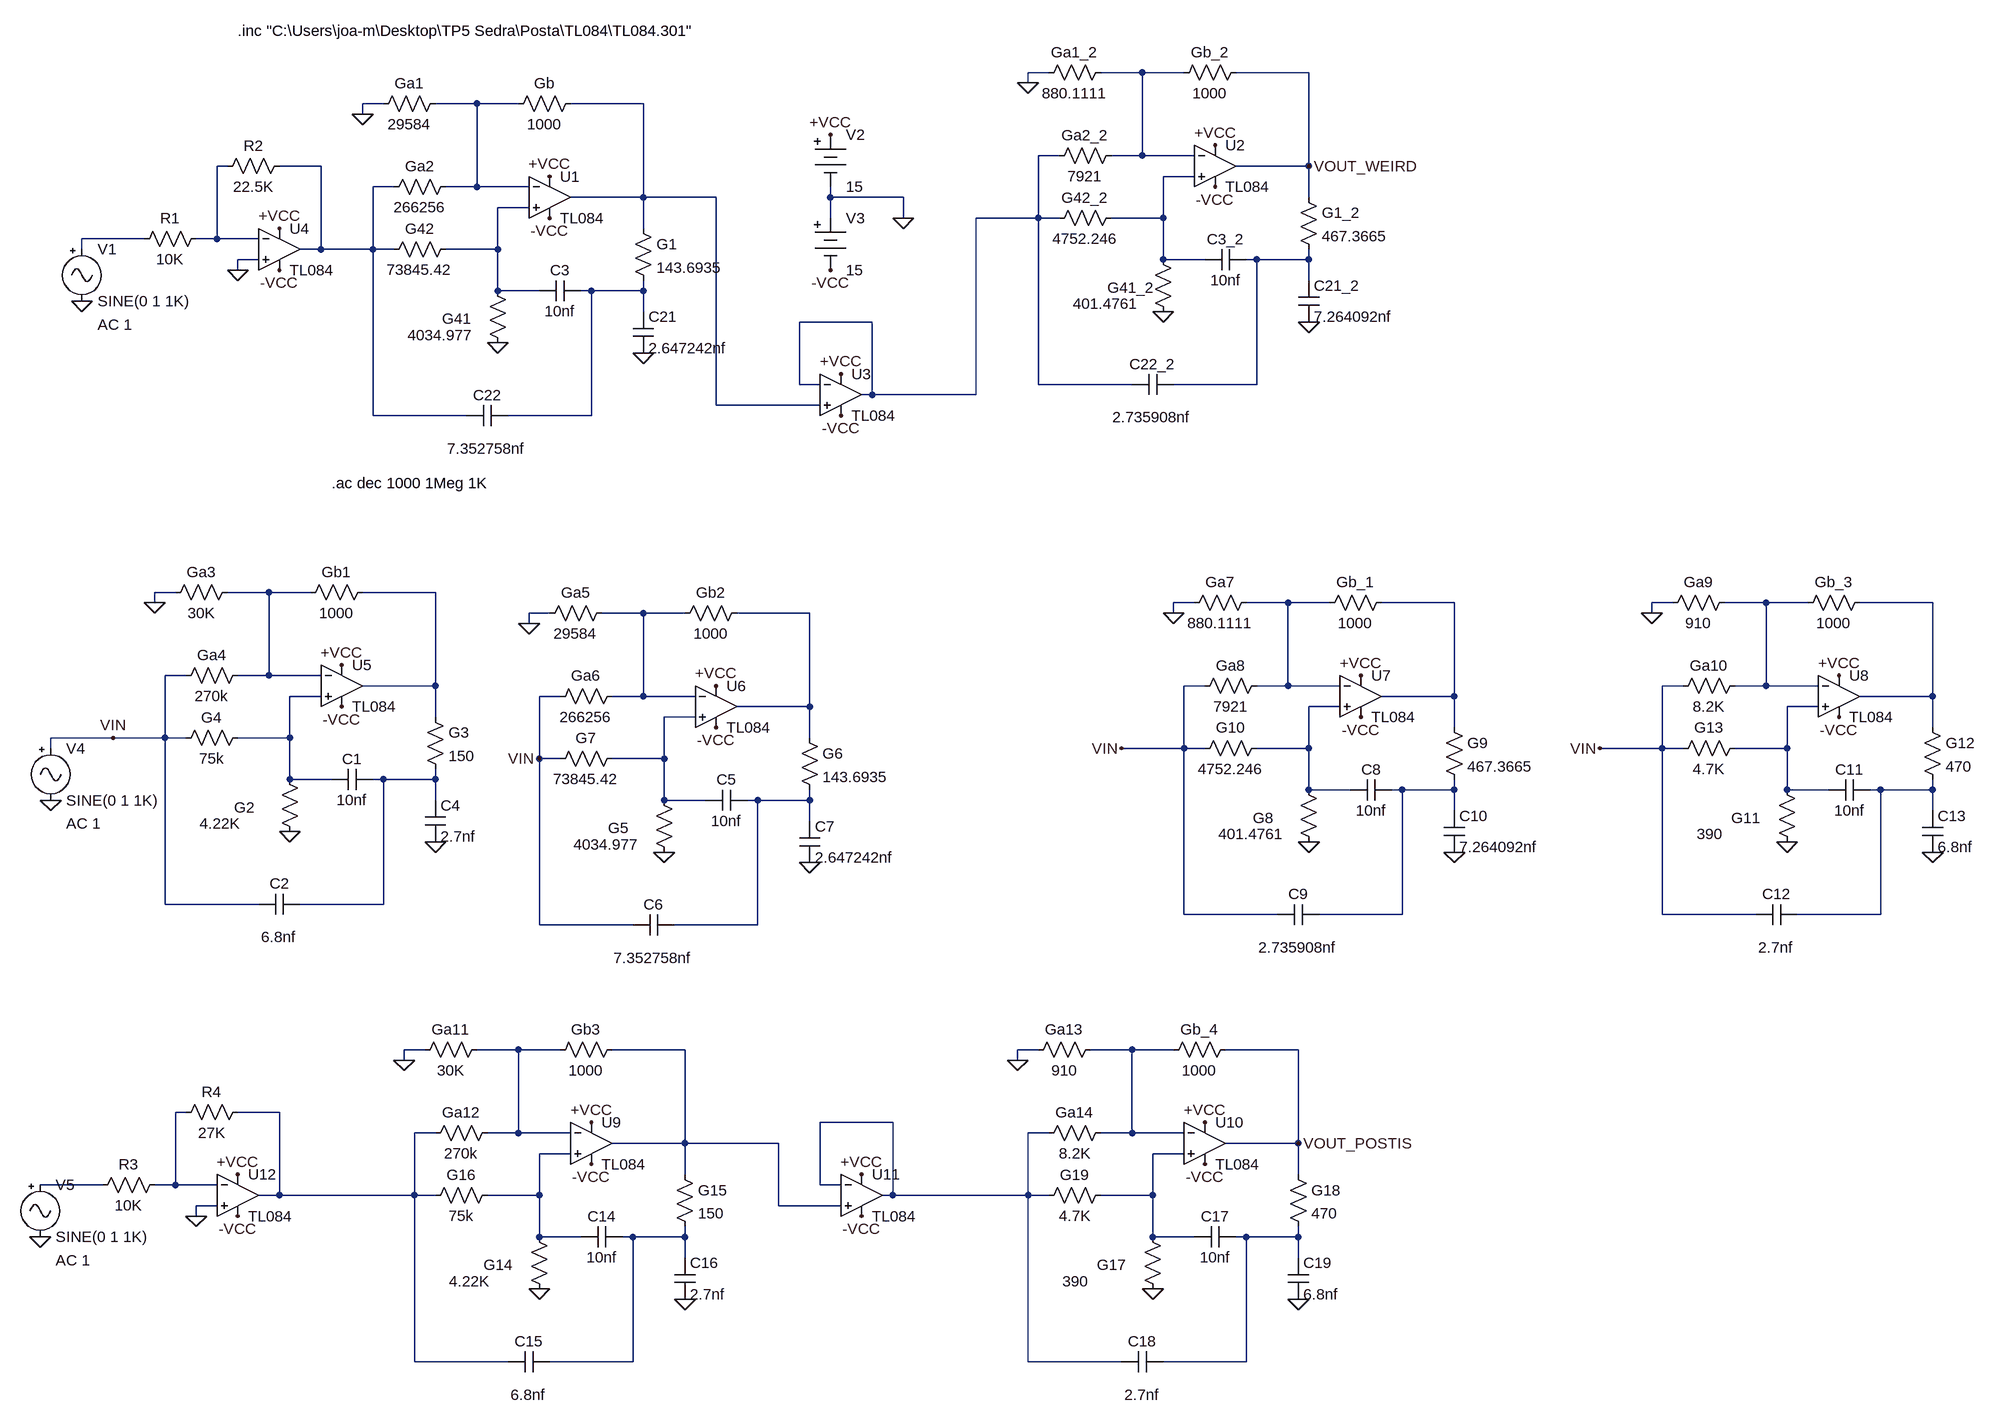
[diagram p0: schematic Sedra.asc]
Sedra.asc, the LTspice schematic file:
Version 4
SHEET 1 3008 2004
WIRE 1168 -48 1136 -48
WIRE 1312 -48 1248 -48
WIRE 1376 -48 1312 -48
WIRE 1568 -48 1456 -48
WIRE 1136 -32 1136 -48
WIRE 144 0 112 0
WIRE 288 0 224 0
WIRE 352 0 288 0
WIRE 544 0 432 0
WIRE 112 16 112 0
WIRE 1184 80 1152 80
WIRE 1312 80 1312 -48
WIRE 1312 80 1264 80
WIRE 1392 80 1312 80
WIRE -96 96 -112 96
WIRE 48 96 -16 96
WIRE 1568 96 1568 -48
WIRE 1568 96 1456 96
WIRE 1392 112 1344 112
WIRE 160 128 128 128
WIRE 288 128 288 0
WIRE 288 128 240 128
WIRE 368 128 288 128
WIRE 544 144 544 0
WIRE 544 144 432 144
WIRE 656 144 544 144
WIRE 832 144 832 128
WIRE 944 144 832 144
WIRE 1568 144 1568 96
WIRE 368 160 320 160
WIRE 832 176 832 144
WIRE 944 176 944 144
WIRE 1152 176 1152 80
WIRE 1152 176 1056 176
WIRE 1184 176 1152 176
WIRE 1344 176 1344 112
WIRE 1344 176 1264 176
WIRE 544 192 544 144
WIRE -224 208 -320 208
WIRE -112 208 -112 96
WIRE -112 208 -144 208
WIRE -48 208 -112 208
WIRE -320 224 -320 208
WIRE 48 224 48 96
WIRE 48 224 16 224
WIRE 128 224 128 128
WIRE 128 224 48 224
WIRE 160 224 128 224
WIRE 320 224 320 160
WIRE 320 224 240 224
WIRE -48 240 -80 240
WIRE 1344 240 1344 176
WIRE 1408 240 1344 240
WIRE 1488 240 1472 240
WIRE 1568 240 1568 224
WIRE 1568 240 1488 240
WIRE -80 256 -80 240
WIRE 1568 272 1568 240
WIRE 320 288 320 224
WIRE 384 288 320 288
WIRE 464 288 448 288
WIRE 544 288 544 272
WIRE 544 288 464 288
WIRE 544 320 544 288
WIRE 896 336 784 336
WIRE 784 432 784 336
WIRE 816 432 784 432
WIRE 1152 432 1152 176
WIRE 1296 432 1152 432
WIRE 1488 432 1488 240
WIRE 1488 432 1360 432
WIRE 896 448 896 336
WIRE 896 448 880 448
WIRE 1056 448 1056 176
WIRE 1056 448 896 448
WIRE 656 464 656 144
WIRE 816 464 656 464
WIRE 128 480 128 224
WIRE 272 480 128 480
WIRE 464 480 464 288
WIRE 464 480 336 480
WIRE -176 752 -208 752
WIRE -32 752 -96 752
WIRE 32 752 -32 752
WIRE 224 752 112 752
WIRE -208 768 -208 752
WIRE 1392 768 1360 768
WIRE 1536 768 1472 768
WIRE 1600 768 1536 768
WIRE 1792 768 1680 768
WIRE 2128 768 2096 768
WIRE 2272 768 2208 768
WIRE 2336 768 2272 768
WIRE 2528 768 2416 768
WIRE 400 784 368 784
WIRE 544 784 480 784
WIRE 608 784 544 784
WIRE 800 784 688 784
WIRE 1360 784 1360 768
WIRE 2096 784 2096 768
WIRE 368 800 368 784
WIRE -160 880 -192 880
WIRE -32 880 -32 752
WIRE -32 880 -80 880
WIRE 48 880 -32 880
WIRE 224 896 224 752
WIRE 224 896 112 896
WIRE 1408 896 1376 896
WIRE 1536 896 1536 768
WIRE 1536 896 1488 896
WIRE 1616 896 1536 896
WIRE 2144 896 2112 896
WIRE 2272 896 2272 768
WIRE 2272 896 2224 896
WIRE 2352 896 2272 896
WIRE 48 912 0 912
WIRE 416 912 384 912
WIRE 544 912 544 784
WIRE 544 912 496 912
WIRE 624 912 544 912
WIRE 1792 912 1792 768
WIRE 1792 912 1680 912
WIRE 2528 912 2528 768
WIRE 2528 912 2416 912
WIRE 800 928 800 784
WIRE 800 928 688 928
WIRE 1616 928 1568 928
WIRE 2352 928 2304 928
WIRE 224 944 224 896
WIRE 624 944 576 944
WIRE 1792 960 1792 912
WIRE 2528 960 2528 912
WIRE -272 976 -368 976
WIRE -192 976 -192 880
WIRE -192 976 -272 976
WIRE -160 976 -192 976
WIRE 0 976 0 912
WIRE 0 976 -80 976
WIRE 800 976 800 928
WIRE -368 992 -368 976
WIRE 1376 992 1376 896
WIRE 1376 992 1280 992
WIRE 1408 992 1376 992
WIRE 1568 992 1568 928
WIRE 1568 992 1488 992
WIRE 2112 992 2112 896
WIRE 2112 992 2016 992
WIRE 2144 992 2112 992
WIRE 2304 992 2304 928
WIRE 2304 992 2224 992
WIRE 384 1008 384 912
WIRE 416 1008 384 1008
WIRE 576 1008 576 944
WIRE 576 1008 496 1008
WIRE 0 1040 0 976
WIRE 64 1040 0 1040
WIRE 144 1040 128 1040
WIRE 224 1040 224 1024
WIRE 224 1040 144 1040
WIRE 1568 1056 1568 992
WIRE 1632 1056 1568 1056
WIRE 1712 1056 1696 1056
WIRE 1792 1056 1792 1040
WIRE 1792 1056 1712 1056
WIRE 2304 1056 2304 992
WIRE 2368 1056 2304 1056
WIRE 2448 1056 2432 1056
WIRE 2528 1056 2528 1040
WIRE 2528 1056 2448 1056
WIRE 224 1072 224 1040
WIRE 576 1072 576 1008
WIRE 640 1072 576 1072
WIRE 720 1072 704 1072
WIRE 800 1072 800 1056
WIRE 800 1072 720 1072
WIRE 1792 1088 1792 1056
WIRE 2528 1088 2528 1056
WIRE 800 1104 800 1072
WIRE -192 1232 -192 976
WIRE -48 1232 -192 1232
WIRE 144 1232 144 1040
WIRE 144 1232 16 1232
WIRE 1376 1248 1376 992
WIRE 1520 1248 1376 1248
WIRE 1712 1248 1712 1056
WIRE 1712 1248 1584 1248
WIRE 2112 1248 2112 992
WIRE 2256 1248 2112 1248
WIRE 2448 1248 2448 1056
WIRE 2448 1248 2320 1248
WIRE 384 1264 384 1008
WIRE 528 1264 384 1264
WIRE 720 1264 720 1072
WIRE 720 1264 592 1264
WIRE 208 1456 176 1456
WIRE 352 1456 288 1456
WIRE 416 1456 352 1456
WIRE 608 1456 496 1456
WIRE 1152 1456 1120 1456
WIRE 1296 1456 1232 1456
WIRE 1360 1456 1296 1456
WIRE 1552 1456 1440 1456
WIRE 176 1472 176 1456
WIRE 1120 1472 1120 1456
WIRE -160 1552 -176 1552
WIRE -16 1552 -80 1552
WIRE 928 1568 816 1568
WIRE 224 1584 192 1584
WIRE 352 1584 352 1456
WIRE 352 1584 304 1584
WIRE 432 1584 352 1584
WIRE 1168 1584 1136 1584
WIRE 1296 1584 1296 1456
WIRE 1296 1584 1248 1584
WIRE 1376 1584 1296 1584
WIRE 608 1600 608 1456
WIRE 608 1600 496 1600
WIRE 752 1600 608 1600
WIRE 1552 1600 1552 1456
WIRE 1552 1600 1440 1600
WIRE 432 1616 384 1616
WIRE 1376 1616 1328 1616
WIRE 608 1648 608 1600
WIRE 1552 1648 1552 1600
WIRE -288 1664 -384 1664
WIRE -176 1664 -176 1552
WIRE -176 1664 -208 1664
WIRE -112 1664 -176 1664
WIRE 816 1664 816 1568
WIRE 848 1664 816 1664
WIRE -16 1680 -16 1552
WIRE -16 1680 -48 1680
WIRE 192 1680 192 1584
WIRE 192 1680 -16 1680
WIRE 224 1680 192 1680
WIRE 384 1680 384 1616
WIRE 384 1680 304 1680
WIRE 928 1680 928 1568
WIRE 928 1680 912 1680
WIRE 1136 1680 1136 1584
WIRE 1136 1680 928 1680
WIRE 1168 1680 1136 1680
WIRE 1328 1680 1328 1616
WIRE 1328 1680 1248 1680
WIRE -112 1696 -144 1696
WIRE 752 1696 752 1600
WIRE 848 1696 752 1696
WIRE -144 1712 -144 1696
WIRE 384 1744 384 1680
WIRE 448 1744 384 1744
WIRE 528 1744 512 1744
WIRE 608 1744 608 1728
WIRE 608 1744 528 1744
WIRE 1328 1744 1328 1680
WIRE 1392 1744 1328 1744
WIRE 1472 1744 1456 1744
WIRE 1552 1744 1552 1728
WIRE 1552 1744 1472 1744
WIRE 608 1776 608 1744
WIRE 1552 1776 1552 1744
WIRE 192 1936 192 1680
WIRE 336 1936 192 1936
WIRE 528 1936 528 1744
WIRE 528 1936 400 1936
WIRE 1136 1936 1136 1680
WIRE 1280 1936 1136 1936
WIRE 1472 1936 1472 1744
WIRE 1472 1936 1344 1936
FLAG 112 16 0
FLAG 544 384 0
FLAG 320 368 0
FLAG -320 304 0
FLAG 944 176 0
FLAG 400 112 +VCC
FLAG 832 48 +VCC
FLAG 400 176 -VCC
FLAG 832 256 -VCC
FLAG 1136 -32 0
FLAG 1568 336 0
FLAG 1344 320 0
FLAG 1424 64 +VCC
FLAG 1424 128 -VCC
FLAG 848 416 +VCC
FLAG 848 480 -VCC
FLAG -16 192 +VCC
FLAG -16 256 -VCC
FLAG -80 256 0
FLAG -208 768 0
FLAG 224 1136 0
FLAG 0 1120 0
FLAG -368 1072 0
FLAG 80 864 +VCC
FLAG 80 928 -VCC
FLAG 368 800 0
FLAG 800 1168 0
FLAG 576 1152 0
FLAG 656 896 +VCC
FLAG 656 960 -VCC
FLAG -272 976 VIN
FLAG 384 1008 VIN
FLAG 1360 784 0
FLAG 1792 1152 0
FLAG 1568 1136 0
FLAG 1648 880 +VCC
FLAG 1648 944 -VCC
FLAG 2096 784 0
FLAG 2528 1152 0
FLAG 2304 1136 0
FLAG 2384 880 +VCC
FLAG 2384 944 -VCC
FLAG 1280 992 VIN
FLAG 2016 992 VIN
FLAG 176 1472 0
FLAG 608 1840 0
FLAG 384 1824 0
FLAG -384 1744 0
FLAG 464 1568 +VCC
FLAG 464 1632 -VCC
FLAG 1120 1472 0
FLAG 1552 1840 0
FLAG 1328 1824 0
FLAG 1408 1568 +VCC
FLAG 1408 1632 -VCC
FLAG 880 1648 +VCC
FLAG 880 1712 -VCC
FLAG -80 1648 +VCC
FLAG -80 1712 -VCC
FLAG -144 1712 0
FLAG 1568 96 VOUT_WEIRD
FLAG 1552 1600 VOUT_POSTIS
SYMBOL Opamps\\opamp2 400 80 R0
SYMATTR InstName U1
SYMATTR Value TL084
SYMATTR SpiceModel TL084
SYMBOL res 128 16 R270
WINDOW 0 32 56 VTop 2
WINDOW 3 0 56 VBottom 2
SYMATTR InstName Ga1
SYMATTR Value 29584
SYMBOL res 336 16 R270
WINDOW 0 32 56 VTop 2
WINDOW 3 0 56 VBottom 2
SYMATTR InstName Gb
SYMATTR Value 1000
SYMBOL res 304 272 R0
WINDOW 0 -70 59 Left 2
WINDOW 3 -123 84 Left 2
SYMATTR InstName G41
SYMATTR Value 4034.977
SYMBOL res 528 176 R0
SYMATTR InstName G1
SYMATTR Value 143.6935
SYMBOL cap 448 272 R90
WINDOW 0 0 32 VBottom 2
WINDOW 3 32 32 VTop 2
SYMATTR InstName C3
SYMATTR Value 10nf
SYMBOL cap 336 464 R90
WINDOW 0 0 32 VBottom 2
WINDOW 3 51 33 VTop 2
SYMATTR InstName C22
SYMATTR Value 7.352758nf
SYMBOL cap 528 320 R0
SYMATTR InstName C21
SYMATTR Value 2.647242nf
SYMBOL Misc\\signal -320 208 R0
WINDOW 123 24 132 Left 2
WINDOW 39 0 0 Left 0
SYMATTR Value2 AC 1
SYMATTR InstName V1
SYMBOL Misc\\battery 832 32 R0
WINDOW 123 0 0 Left 0
WINDOW 39 0 0 Left 0
SYMATTR InstName V2
SYMATTR Value 15
SYMBOL Misc\\battery 832 160 R0
WINDOW 123 0 0 Left 0
WINDOW 39 0 0 Left 0
SYMATTR InstName V3
SYMATTR Value 15
SYMBOL res 256 112 R90
WINDOW 0 0 56 VBottom 2
WINDOW 3 32 56 VTop 2
SYMATTR InstName Ga2
SYMATTR Value 266256
SYMBOL res 256 208 R90
WINDOW 0 0 56 VBottom 2
WINDOW 3 32 56 VTop 2
SYMATTR InstName G42
SYMATTR Value 73845.42
SYMBOL Opamps\\opamp2 1424 32 R0
SYMATTR InstName U2
SYMATTR Value TL084
SYMATTR SpiceModel TL084
SYMBOL res 1152 -32 R270
WINDOW 0 32 56 VTop 2
WINDOW 3 0 56 VBottom 2
SYMATTR InstName Ga1_2
SYMATTR Value 880.1111
SYMBOL res 1360 -32 R270
WINDOW 0 32 56 VTop 2
WINDOW 3 0 56 VBottom 2
SYMATTR InstName Gb_2
SYMATTR Value 1000
SYMBOL res 1328 224 R0
WINDOW 0 -70 59 Left 2
WINDOW 3 -123 84 Left 2
SYMATTR InstName G41_2
SYMATTR Value 401.4761
SYMBOL res 1552 128 R0
SYMATTR InstName G1_2
SYMATTR Value 467.3665
SYMBOL cap 1472 224 R90
WINDOW 0 0 32 VBottom 2
WINDOW 3 32 32 VTop 2
SYMATTR InstName C3_2
SYMATTR Value 10nf
SYMBOL cap 1360 416 R90
WINDOW 0 0 32 VBottom 2
WINDOW 3 51 33 VTop 2
SYMATTR InstName C22_2
SYMATTR Value 2.735908nf
SYMBOL cap 1552 272 R0
SYMATTR InstName C21_2
SYMATTR Value 7.264092nf
SYMBOL res 1280 64 R90
WINDOW 0 0 56 VBottom 2
WINDOW 3 32 56 VTop 2
SYMATTR InstName Ga2_2
SYMATTR Value 7921
SYMBOL res 1280 160 R90
WINDOW 0 0 56 VBottom 2
WINDOW 3 32 56 VTop 2
SYMATTR InstName G42_2
SYMATTR Value 4752.246
SYMBOL Opamps\\opamp2 848 384 R0
SYMATTR InstName U3
SYMATTR Value TL084
SYMATTR SpiceModel TL084
SYMBOL Opamps\\opamp2 -16 160 R0
SYMATTR InstName U4
SYMATTR Value TL084
SYMATTR SpiceModel TL084
SYMBOL res -128 192 R90
WINDOW 0 0 56 VBottom 2
WINDOW 3 32 56 VTop 2
SYMATTR InstName R1
SYMATTR Value 10K
SYMBOL res 0 80 R90
WINDOW 0 0 56 VBottom 2
WINDOW 3 32 56 VTop 2
SYMATTR InstName R2
SYMATTR Value 22.5K
SYMBOL Opamps\\opamp2 80 832 R0
SYMATTR InstName U5
SYMATTR Value TL084
SYMATTR SpiceModel TL084
SYMBOL res -192 768 R270
WINDOW 0 32 56 VTop 2
WINDOW 3 0 56 VBottom 2
SYMATTR InstName Ga3
SYMATTR Value 30K
SYMBOL res 16 768 R270
WINDOW 0 32 56 VTop 2
WINDOW 3 0 56 VBottom 2
SYMATTR InstName Gb1
SYMATTR Value 1000
SYMBOL res -16 1024 R0
WINDOW 0 -70 59 Left 2
WINDOW 3 -123 84 Left 2
SYMATTR InstName G2
SYMATTR Value 4.22K
SYMBOL res 208 928 R0
SYMATTR InstName G3
SYMATTR Value 150
SYMBOL cap 128 1024 R90
WINDOW 0 0 32 VBottom 2
WINDOW 3 32 32 VTop 2
SYMATTR InstName C1
SYMATTR Value 10nf
SYMBOL cap 16 1216 R90
WINDOW 0 0 32 VBottom 2
WINDOW 3 51 33 VTop 2
SYMATTR InstName C2
SYMATTR Value 6.8nf
SYMBOL cap 208 1072 R0
SYMATTR InstName C4
SYMATTR Value 2.7nf
SYMBOL Misc\\signal -368 976 R0
WINDOW 123 24 132 Left 2
WINDOW 39 0 0 Left 0
SYMATTR Value2 AC 1
SYMATTR InstName V4
SYMBOL res -64 864 R90
WINDOW 0 0 56 VBottom 2
WINDOW 3 32 56 VTop 2
SYMATTR InstName Ga4
SYMATTR Value 270k
SYMBOL res -64 960 R90
WINDOW 0 0 56 VBottom 2
WINDOW 3 32 56 VTop 2
SYMATTR InstName G4
SYMATTR Value 75k
SYMBOL Opamps\\opamp2 656 864 R0
SYMATTR InstName U6
SYMATTR Value TL084
SYMATTR SpiceModel TL084
SYMBOL res 384 800 R270
WINDOW 0 32 56 VTop 2
WINDOW 3 0 56 VBottom 2
SYMATTR InstName Ga5
SYMATTR Value 29584
SYMBOL res 592 800 R270
WINDOW 0 32 56 VTop 2
WINDOW 3 0 56 VBottom 2
SYMATTR InstName Gb2
SYMATTR Value 1000
SYMBOL res 560 1056 R0
WINDOW 0 -70 59 Left 2
WINDOW 3 -123 84 Left 2
SYMATTR InstName G5
SYMATTR Value 4034.977
SYMBOL res 784 960 R0
SYMATTR InstName G6
SYMATTR Value 143.6935
SYMBOL cap 704 1056 R90
WINDOW 0 0 32 VBottom 2
WINDOW 3 32 32 VTop 2
SYMATTR InstName C5
SYMATTR Value 10nf
SYMBOL cap 592 1248 R90
WINDOW 0 0 32 VBottom 2
WINDOW 3 51 33 VTop 2
SYMATTR InstName C6
SYMATTR Value 7.352758nf
SYMBOL cap 784 1104 R0
SYMATTR InstName C7
SYMATTR Value 2.647242nf
SYMBOL res 512 896 R90
WINDOW 0 0 56 VBottom 2
WINDOW 3 32 56 VTop 2
SYMATTR InstName Ga6
SYMATTR Value 266256
SYMBOL res 512 992 R90
WINDOW 0 0 56 VBottom 2
WINDOW 3 32 56 VTop 2
SYMATTR InstName G7
SYMATTR Value 73845.42
SYMBOL Opamps\\opamp2 1648 848 R0
SYMATTR InstName U7
SYMATTR Value TL084
SYMATTR SpiceModel TL084
SYMBOL res 1376 784 R270
WINDOW 0 32 56 VTop 2
WINDOW 3 0 56 VBottom 2
SYMATTR InstName Ga7
SYMATTR Value 880.1111
SYMBOL res 1584 784 R270
WINDOW 0 32 56 VTop 2
WINDOW 3 0 56 VBottom 2
SYMATTR InstName Gb_1
SYMATTR Value 1000
SYMBOL res 1552 1040 R0
WINDOW 0 -70 59 Left 2
WINDOW 3 -123 84 Left 2
SYMATTR InstName G8
SYMATTR Value 401.4761
SYMBOL res 1776 944 R0
SYMATTR InstName G9
SYMATTR Value 467.3665
SYMBOL cap 1696 1040 R90
WINDOW 0 0 32 VBottom 2
WINDOW 3 32 32 VTop 2
SYMATTR InstName C8
SYMATTR Value 10nf
SYMBOL cap 1584 1232 R90
WINDOW 0 0 32 VBottom 2
WINDOW 3 51 33 VTop 2
SYMATTR InstName C9
SYMATTR Value 2.735908nf
SYMBOL cap 1776 1088 R0
SYMATTR InstName C10
SYMATTR Value 7.264092nf
SYMBOL res 1504 880 R90
WINDOW 0 0 56 VBottom 2
WINDOW 3 32 56 VTop 2
SYMATTR InstName Ga8
SYMATTR Value 7921
SYMBOL res 1504 976 R90
WINDOW 0 0 56 VBottom 2
WINDOW 3 32 56 VTop 2
SYMATTR InstName G10
SYMATTR Value 4752.246
SYMBOL Opamps\\opamp2 2384 848 R0
SYMATTR InstName U8
SYMATTR Value TL084
SYMATTR SpiceModel TL084
SYMBOL res 2112 784 R270
WINDOW 0 32 56 VTop 2
WINDOW 3 0 56 VBottom 2
SYMATTR InstName Ga9
SYMATTR Value 910
SYMBOL res 2320 784 R270
WINDOW 0 32 56 VTop 2
WINDOW 3 0 56 VBottom 2
SYMATTR InstName Gb_3
SYMATTR Value 1000
SYMBOL res 2288 1040 R0
WINDOW 0 -70 59 Left 2
WINDOW 3 -123 84 Left 2
SYMATTR InstName G11
SYMATTR Value 390
SYMBOL res 2512 944 R0
SYMATTR InstName G12
SYMATTR Value 470
SYMBOL cap 2432 1040 R90
WINDOW 0 0 32 VBottom 2
WINDOW 3 32 32 VTop 2
SYMATTR InstName C11
SYMATTR Value 10nf
SYMBOL cap 2320 1232 R90
WINDOW 0 0 32 VBottom 2
WINDOW 3 51 33 VTop 2
SYMATTR InstName C12
SYMATTR Value 2.7nf
SYMBOL cap 2512 1088 R0
SYMATTR InstName C13
SYMATTR Value 6.8nf
SYMBOL res 2240 880 R90
WINDOW 0 0 56 VBottom 2
WINDOW 3 32 56 VTop 2
SYMATTR InstName Ga10
SYMATTR Value 8.2K
SYMBOL res 2240 976 R90
WINDOW 0 0 56 VBottom 2
WINDOW 3 32 56 VTop 2
SYMATTR InstName G13
SYMATTR Value 4.7K
SYMBOL Opamps\\opamp2 464 1536 R0
SYMATTR InstName U9
SYMATTR Value TL084
SYMATTR SpiceModel TL084
SYMBOL res 192 1472 R270
WINDOW 0 32 56 VTop 2
WINDOW 3 0 56 VBottom 2
SYMATTR InstName Ga11
SYMATTR Value 30K
SYMBOL res 400 1472 R270
WINDOW 0 32 56 VTop 2
WINDOW 3 0 56 VBottom 2
SYMATTR InstName Gb3
SYMATTR Value 1000
SYMBOL res 368 1728 R0
WINDOW 0 -70 59 Left 2
WINDOW 3 -123 84 Left 2
SYMATTR InstName G14
SYMATTR Value 4.22K
SYMBOL res 592 1632 R0
SYMATTR InstName G15
SYMATTR Value 150
SYMBOL cap 512 1728 R90
WINDOW 0 0 32 VBottom 2
WINDOW 3 32 32 VTop 2
SYMATTR InstName C14
SYMATTR Value 10nf
SYMBOL cap 400 1920 R90
WINDOW 0 0 32 VBottom 2
WINDOW 3 51 33 VTop 2
SYMATTR InstName C15
SYMATTR Value 6.8nf
SYMBOL cap 592 1776 R0
SYMATTR InstName C16
SYMATTR Value 2.7nf
SYMBOL Misc\\signal -384 1648 R0
WINDOW 123 24 132 Left 2
WINDOW 39 0 0 Left 0
SYMATTR Value2 AC 1
SYMATTR InstName V5
SYMBOL res 320 1568 R90
WINDOW 0 0 56 VBottom 2
WINDOW 3 32 56 VTop 2
SYMATTR InstName Ga12
SYMATTR Value 270k
SYMBOL res 320 1664 R90
WINDOW 0 0 56 VBottom 2
WINDOW 3 32 56 VTop 2
SYMATTR InstName G16
SYMATTR Value 75k
SYMBOL Opamps\\opamp2 1408 1536 R0
SYMATTR InstName U10
SYMATTR Value TL084
SYMATTR SpiceModel TL084
SYMBOL res 1136 1472 R270
WINDOW 0 32 56 VTop 2
WINDOW 3 0 56 VBottom 2
SYMATTR InstName Ga13
SYMATTR Value 910
SYMBOL res 1344 1472 R270
WINDOW 0 32 56 VTop 2
WINDOW 3 0 56 VBottom 2
SYMATTR InstName Gb_4
SYMATTR Value 1000
SYMBOL res 1312 1728 R0
WINDOW 0 -70 59 Left 2
WINDOW 3 -123 84 Left 2
SYMATTR InstName G17
SYMATTR Value 390
SYMBOL res 1536 1632 R0
SYMATTR InstName G18
SYMATTR Value 470
SYMBOL cap 1456 1728 R90
WINDOW 0 0 32 VBottom 2
WINDOW 3 32 32 VTop 2
SYMATTR InstName C17
SYMATTR Value 10nf
SYMBOL cap 1344 1920 R90
WINDOW 0 0 32 VBottom 2
WINDOW 3 51 33 VTop 2
SYMATTR InstName C18
SYMATTR Value 2.7nf
SYMBOL cap 1536 1776 R0
SYMATTR InstName C19
SYMATTR Value 6.8nf
SYMBOL res 1264 1568 R90
WINDOW 0 0 56 VBottom 2
WINDOW 3 32 56 VTop 2
SYMATTR InstName Ga14
SYMATTR Value 8.2K
SYMBOL res 1264 1664 R90
WINDOW 0 0 56 VBottom 2
WINDOW 3 32 56 VTop 2
SYMATTR InstName G19
SYMATTR Value 4.7K
SYMBOL Opamps\\opamp2 880 1616 R0
SYMATTR InstName U11
SYMATTR Value TL084
SYMATTR SpiceModel TL084
SYMBOL Opamps\\opamp2 -80 1616 R0
SYMATTR InstName U12
SYMATTR Value TL084
SYMATTR SpiceModel TL084
SYMBOL res -192 1648 R90
WINDOW 0 0 56 VBottom 2
WINDOW 3 32 56 VTop 2
SYMATTR InstName R3
SYMATTR Value 10K
SYMBOL res -64 1536 R90
WINDOW 0 0 56 VBottom 2
WINDOW 3 32 56 VTop 2
SYMATTR InstName R4
SYMATTR Value 27K
TEXT -80 -112 Left 2 !.inc "C:\\Users\\joa-m\\Desktop\\TP5 Sedra\\Posta\\TL084\\TL084.301"
TEXT 64 584 Left 2 !.ac dec 1000 1Meg 1K

The netlist it stands for:
* Sedra.asc
XU1 N008 N002 +VCC -VCC N003 TL084 TL084  ; pins In+ In- V+ V- OUT
R§Ga1 0 N002 29584
R§Gb N002 N003 1000
R§G41 N008 0 4034.977
R§G1 N003 N011 143.6935
C3 N011 N008 10nf
C22 N011 N006 7.352758nf
C21 N011 0 2.647242nf
V1 N009 0 SINE(0 1 1K) AC 1
V2 +VCC 0 15
V3 0 -VCC 15
R§Ga2 N002 N006 266256
R§G42 N008 N006 73845.42
XU2 N007 N001 +VCC -VCC VOUT_WEIRD TL084 TL084  ; pins In+ In- V+ V- OUT
R§Ga1_2 0 N001 880.1111
R§Gb_2 N001 VOUT_WEIRD 1000
R§G41_2 N007 0 401.4761
R§G1_2 VOUT_WEIRD N010 467.3665
C3_2 N010 N007 10nf
C22_2 N010 N004 2.735908nf
C21_2 N010 0 7.264092nf
R§Ga2_2 N001 N004 7921
R§G42_2 N007 N004 4752.246
XU3 N003 N004 +VCC -VCC N004 TL084 TL084  ; pins In+ In- V+ V- OUT
XU4 0 N005 +VCC -VCC N006 TL084 TL084  ; pins In+ In- V+ V- OUT
R1 N005 N009 10K
R2 N006 N005 22.5K
XU5 N020 N012 +VCC -VCC N013 TL084 TL084  ; pins In+ In- V+ V- OUT
R§Ga3 0 N012 30K
R§Gb1 N012 N013 1000
R§G2 N020 0 4.22K
R§G3 N013 N024 150
C1 N024 N020 10nf
C2 N024 VIN 6.8nf
C4 N024 0 2.7nf
V4 VIN 0 SINE(0 1 1K) AC 1
R§Ga4 N012 VIN 270k
R§G4 N020 VIN 75k
XU6 N023 N018 +VCC -VCC N019 TL084 TL084  ; pins In+ In- V+ V- OUT
R§Ga5 0 N018 29584
R§Gb2 N018 N019 1000
R§G5 N023 0 4034.977
R§G6 N019 N027 143.6935
C5 N027 N023 10nf
C6 N027 VIN 7.352758nf
C7 N027 0 2.647242nf
R§Ga6 N018 VIN 266256
R§G7 N023 VIN 73845.42
XU7 N021 N014 +VCC -VCC N015 TL084 TL084  ; pins In+ In- V+ V- OUT
R§Ga7 0 N014 880.1111
R§Gb_1 N014 N015 1000
R§G8 N021 0 401.4761
R§G9 N015 N025 467.3665
C8 N025 N021 10nf
C9 N025 VIN 2.735908nf
C10 N025 0 7.264092nf
R§Ga8 N014 VIN 7921
R§G10 N021 VIN 4752.246
XU8 N022 N016 +VCC -VCC N017 TL084 TL084  ; pins In+ In- V+ V- OUT
R§Ga9 0 N016 910
R§Gb_3 N016 N017 1000
R§G11 N022 0 390
R§G12 N017 N026 470
C11 N026 N022 10nf
C12 N026 VIN 2.7nf
C13 N026 0 6.8nf
R§Ga10 N016 VIN 8.2K
R§G13 N022 VIN 4.7K
XU9 N034 N028 +VCC -VCC N029 TL084 TL084  ; pins In+ In- V+ V- OUT
R§Ga11 0 N028 30K
R§Gb3 N028 N029 1000
R§G14 N034 0 4.22K
R§G15 N029 N037 150
C14 N037 N034 10nf
C15 N037 N032 6.8nf
C16 N037 0 2.7nf
V5 N036 0 SINE(0 1 1K) AC 1
R§Ga12 N028 N032 270k
R§G16 N034 N032 75k
XU10 N035 N030 +VCC -VCC VOUT_POSTIS TL084 TL084  ; pins In+ In- V+ V- OUT
R§Ga13 0 N030 910
R§Gb_4 N030 VOUT_POSTIS 1000
R§G17 N035 0 390
R§G18 VOUT_POSTIS N038 470
C17 N038 N035 10nf
C18 N038 N033 2.7nf
C19 N038 0 6.8nf
R§Ga14 N030 N033 8.2K
R§G19 N035 N033 4.7K
XU11 N029 N033 +VCC -VCC N033 TL084 TL084  ; pins In+ In- V+ V- OUT
XU12 0 N031 +VCC -VCC N032 TL084 TL084  ; pins In+ In- V+ V- OUT
R3 N031 N036 10K
R4 N032 N031 27K
.inc "C:\Users\joa-m\Desktop\TP5 Sedra\Posta\TL084\TL084.301"
.ac dec 1000 1Meg 1K
.backanno
.end